# Altium project Decoupe_DMX.PrjPcb
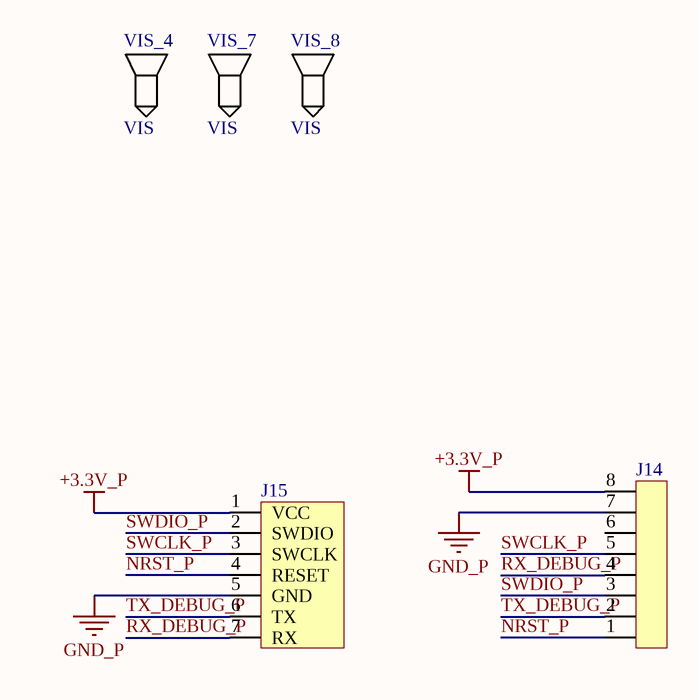
[diagram p0: ProgTool.SchDoc]
6 sheets, 168 parts. Net scope: global (net labels, ports and power ports of the same name join across sheets).
Board file: PCB.PcbDoc
Sheets:
  ProgTool.SchDoc
  IHM.SchDoc
  MCU.SchDoc
  Mechanical.SchDoc
  Outputs.SchDoc
  Power_Supply.SchDoc

## Sheet ProgTool.SchDoc: Carte Découpe DMX
size A4

### Parts
J14  (no value)  [BARF-2X4]
J15  (no value)  [CON_PROG]
VIS_4  VIS  [HOLE3.5mm]
VIS_7  VIS  [HOLE3.5mm]
VIS_8  VIS  [HOLE3.5mm]

### Nets
+3.3V_P: J14.8 J15.1(VCC)
GND_P: J14.7 J15.5(GND)
NRST_P: J14.1 J15.4(RESET)
RX_DEBUG_P: J14.4 J15.7(RX)
SWCLK_P: J14.5 J15.3(SWCLK)
SWDIO_P: J14.3 J15.2(SWDIO)
TX_DEBUG_P: J14.2 J15.6(TX)

Not connected (* = marked no-connect by the designer): J14 6

### Notes on the sheet
- Title
- Size:
- Date:
- A4
- Number:
- Time:
- Revision:
- Sheet
- of
- File:

### Library data of the parts
J14 = CON-8: Connector 8 points
J15 = CON-PROG: Programming Connector

## Sheet IHM.SchDoc: Carte Découpe DMX
size A4
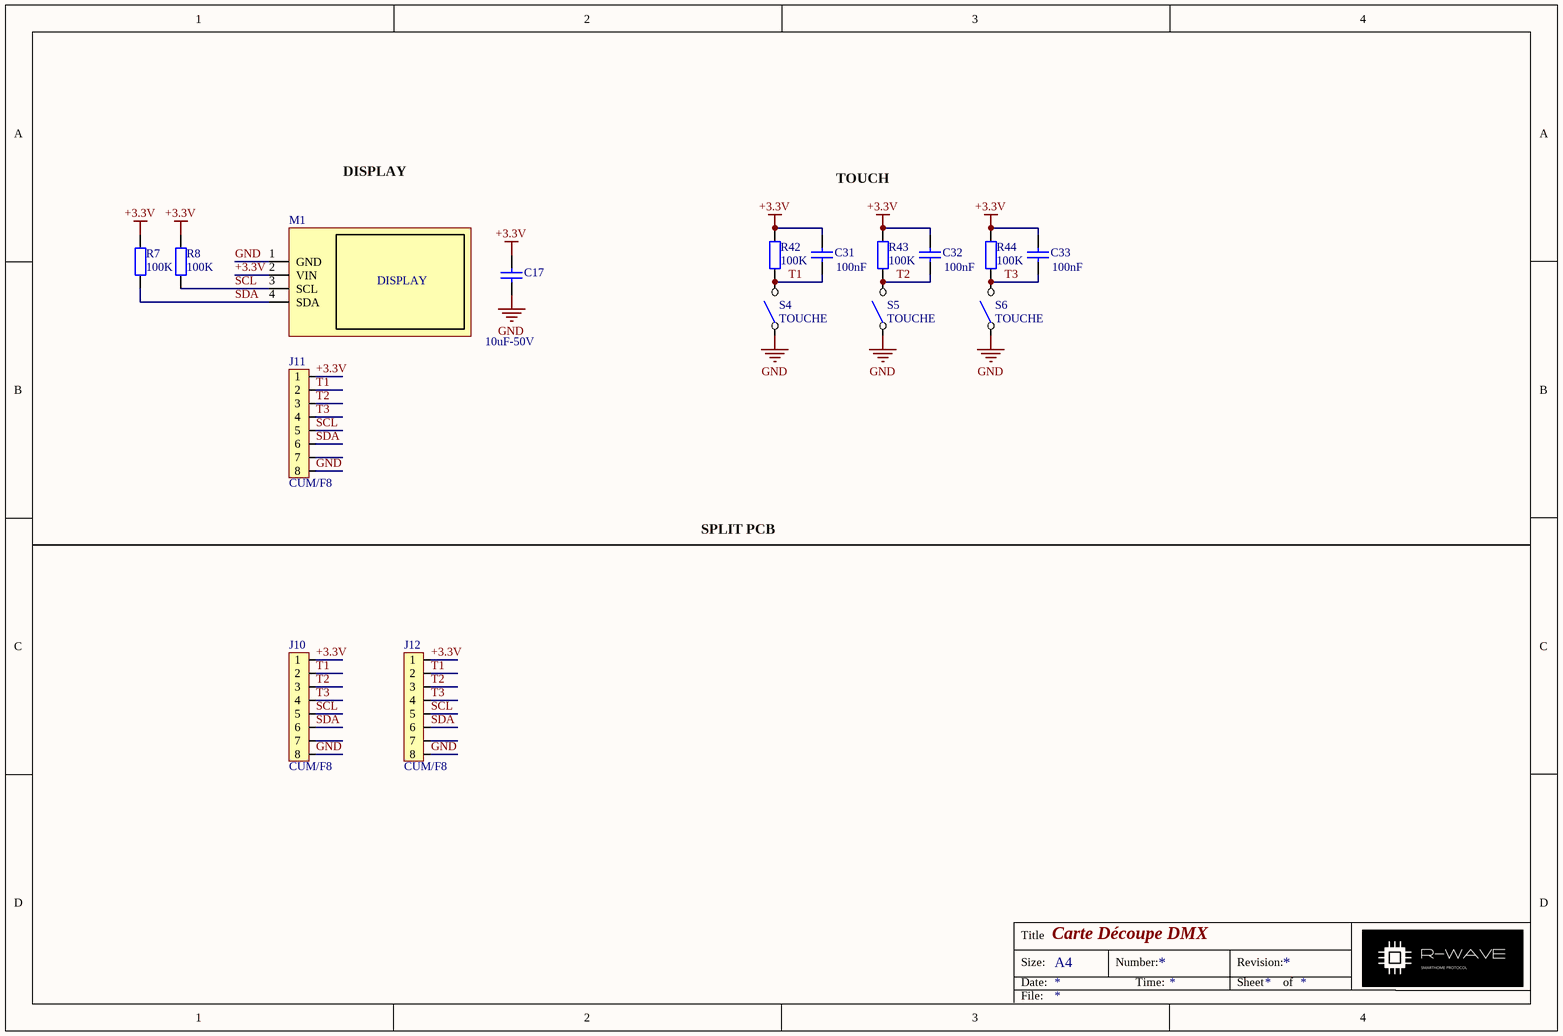
[diagram p1: IHM.SchDoc]

### Parts
C17  10uF-50V  [C1206]
C31  100nF  [C0603]
C32  100nF  [C0603]
C33  100nF  [C0603]
J10  CUM/F8  [BARF-2X4]
J11  CUM/F8  [BARF-2X4]
J12  CUM/F8  [BARF-2X4]
M1  (no value)  [I2C_OLED_0.96]
R7  100K  [R0603]
R8  100K  [R0603]
R42  100K  [R0603]
R43  100K  [R0603]
R44  100K  [R0603]
S4  TOUCHE  [INT-O]
S5  TOUCHE  [INT-O]
S6  TOUCHE  [INT-O]

### Nets
+3.3V: C17.2 C31.2 C32.2 C33.2 J10.1 J11.1 J12.1 M1.2(VIN) R7.2 R8.2 R42.2 R43.2 R44.2
GND: C17.1 J10.8 J11.8 J12.8 M1.1(GND) S4.1 S5.1 S6.1
SCL: J10.5 J11.5 J12.5 M1.3(SCL) R8.1
SDA: J10.6 J11.6 J12.6 M1.4(SDA) R7.1
T1: C31.1 J10.2 J11.2 J12.2 R42.1 S4.4
T2: C32.1 J10.3 J11.3 J12.3 R43.1 S5.4
T3: C33.1 J10.4 J11.4 J12.4 R44.1 S6.4

Not connected (* = marked no-connect by the designer): J10 7; J11 7; J12 7

### Notes on the sheet
- DISPLAY
- TOUCH
- SPLIT PCB
- Title
- Size:
- Date:
- A4
- Number:
- Time:
- Revision:
- Sheet
- of
- File:
- (in symbol I2C-OLED-0.96) DISPLAY

### Library data of the parts
C17 C31-C33 = Cap: Capacitor
  C17: Value: 10uF-50V
  C31-C33: Value: 100nF
J10-J12 = CUM/F8: connecteur 8 points
M1 = I2C-OLED-0.96: I2C OLED 0.96"
R7 R8 R42-R44 = Res: Thin Metal Film Resistor; Value: 100K

## Sheet MCU.SchDoc: Carte Découpe DMX
size A4
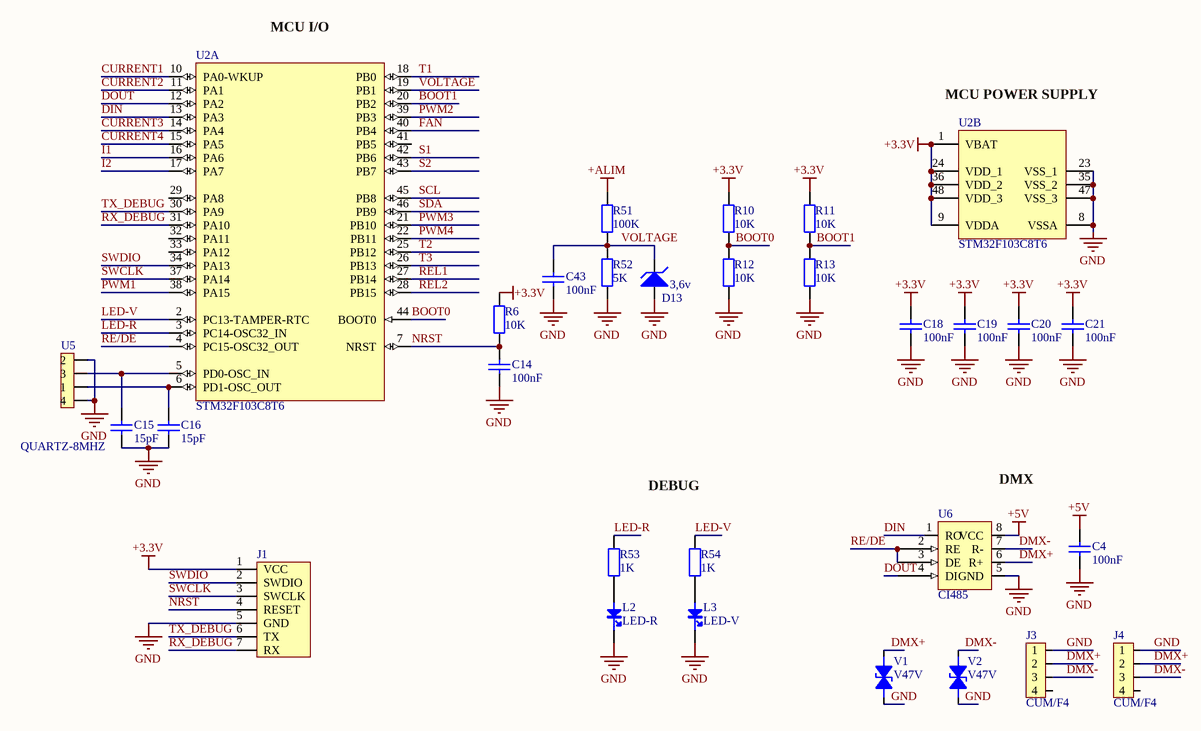
[diagram p2: MCU.SchDoc]

### Parts
C4  100nF  [C0603]
C14  100nF  [C0603]
C15  15pF  [C0603]
C16  15pF  [C0603]
C18  100nF  [C0603]
C19  100nF  [C0603]
C20  100nF  [C0603]
C21  100nF  [C0603]
C43  100nF  [C0603]
D13  3,6v  [SOD123]
J1  (no value)  [CON_PROG]
J3  CUM/F4  [CNT4S]
J4  CUM/F4  [CNT4S]
L2  LED-R  [LED-R1A]
L3  LED-V  [LED-V1A]
R6  10K  [R0603]
R10  10K  [R0603]
R11  10K  [R0603]
R12  10K  [R0603]
R13  10K  [R0603]
R51  100K  [R0603]
R52  5K  [R0603]
R53  1K  [R0603]
R54  1K  [R0603]
U2  STM32F103C8T6  [TQFP-48]  (parts A,B of 2)
U5  QUARTZ-8MHZ  [QUA8G]
U6  CI485  [CIA485A]
V1  V47V  [VAR47A]
V2  V47V  [VAR47A]

### Nets
+3.3V: C18.2 C19.2 C20.2 C21.2 J1.1(VCC) R6.2 R10.2 R11.2 U2.1(VBAT) U2.9(VDDA) U2.24(VDD_1) U2.36(VDD_2) U2.48(VDD_3)
+5V: C4.2 U6.8(VCC)
+ALIM: R51.2
GND: C4.1 C14.1 C15.2 C16.1 C18.1 C19.1 C20.1 C21.1 C43.1 D13.1(A) J1.5(GND) J3.1 J4.1 L2.2 L3.2 R12.1 R13.1 R52.1 U2.8(VSSA) U2.23(VSS_1) U2.35(VSS_2) U2.47(VSS_3) U5.2 U5.4 U6.5(GND) V1.2 V2.2
BOOT0: R10.1 R12.2 U2.44(BOOT0)
BOOT1: R11.1 R13.2 U2.20(PB2)
CURRENT1: U2.10(PA0-WKUP)
CURRENT2: U2.11(PA1)
CURRENT3: U2.14(PA4)
CURRENT4: U2.15(PA5)
DIN: U2.13(PA3) U6.1(RO)
DMX+: J3.2 J4.2 U6.6(R+) V1.1
DMX-: J3.3 J4.3 U6.7(R-) V2.1
DOUT: U2.12(PA2) U6.4(DI)
FAN: U2.40(PB4)
I1: U2.16(PA6)
I2: U2.17(PA7)
LED-R: R53.2 U2.3(PC14-OSC32_IN)
LED-V: R54.2 U2.2(PC13-TAMPER-RTC)
NRST: C14.2 J1.4(RESET) R6.1 U2.7(NRST)
PWM1: U2.38(PA15)
PWM2: U2.39(PB3)
PWM3: U2.21(PB10)
PWM4: U2.22(PB11)
RE/DE: U2.4(PC15-OSC32_OUT) U6.2(RE) U6.3(DE)
REL1: U2.27(PB14)
REL2: U2.28(PB15)
RX_DEBUG: J1.7(RX) U2.31(PA10)
S1: U2.42(PB6)
S2: U2.43(PB7)
SCL: U2.45(PB8)
SDA: U2.46(PB9)
SWCLK: J1.3(SWCLK) U2.37(PA14)
SWDIO: J1.2(SWDIO) U2.34(PA13)
T1: U2.18(PB0)
T2: U2.25(PB12)
T3: U2.26(PB13)
TX_DEBUG: J1.6(TX) U2.30(PA9)
VOLTAGE: C43.2 D13.2(K) R51.1 R52.2 U2.19(PB1)
NetC15_1: C15.1 U2.5(PD0-OSC_IN) U5.3
NetC16_2: C16.2 U2.6(PD1-OSC_OUT) U5.1
NetL2_1: L2.1 R53.1
NetL3_1: L3.1 R54.1

Not connected (* = marked no-connect by the designer): J3 4; J4 4; U2 29(PA8) 32(PA11) 33(PA12) 41(PB5)

### Notes on the sheet
- (near U2) MCU I/O
- (near U2) MCU POWER SUPPLY
- DEBUG
- (near U6) DMX
- Title
- Size:
- Date:
- A4
- Number:
- Time:
- Revision:
- Sheet
- of
- File:

### Library data of the parts
C4 C14-C16 C18-C21 C43 = Cap: Capacitor
  C4 C14 C18-C21 C43: Value: 100nF
  C15 C16: Value: 15pF
D13 = D Zener: Zener Diode; Value: 3,6v
J1 = CON-PROG: Programming Connector
J3 J4 = CUM/F4: connecteur  4 points
L2 = LED-R: LED  piquer ou CMS ou reverse rouge
L3 = LED-V: LED  piquer  ou  CMS verte
R6 R10-R13 R51-R54 = Res: Thin Metal Film Resistor
  R6 R10-R13: Value: 10K
  R51: Value: 100K
  R52: Value: 5K
  R53 R54: Value: 1K
U2 = STM32F103C8T6: ARM Cortex-M3 32-bit MCU, 64 KB Flash, 20 KB Internal RAM, 37 I/Os, 48-pin LQFP, -40 to 85 degC, Tray; Operating Frequency(F) (Processor speed) (MHz): 72; Supply Voltage(Vcc) min (V): 2; FLASH Size (Prog) (kB): 64; Internal RAM Size (kB): 20; I/Os (High Current): 37; A/D Converter: 2x12-bit (10 Channel); Core: ARM Cortex-M3; ComponentLink2Description: Datasheet; ComponentLink3Description: Package Specification; Mounting Technology: Surface Mount; ComponentLink3URL: http://www.st.com/st-web-ui/static/active/en/resource/technical/document/datasheet/DM00058181.pdf; DatasheetVersion: Rev. 16; ComponentLink1URL: http://www.st.com/web/en/home.html; ComponentLink1Description: Manufacturer URL; PartNumber: STM32F103C8T6; Packing: Tray; PackageVersion: Rev. 6, 06/2013; PackageReference: LQFP48; PackageDescription: 48-Pin Low Profile Quad Flat Package, 7 x 7 mm Body, 0.5 mm Pitch; ComponentLink2URL: http://www.st.com/st-web-ui/static/active/en/resource/technical/document/datasheet/CD00161566.pdf
U5 = QUARTZ-8MHZ: QUARTZ 8 MHZ CMS
U6 = CI485: DRIVER  RS485
V1 V2 = V47V: VARISTANCE 47V BOITIER 1206

## Sheet Mechanical.SchDoc: Carte Découpe DMX
size A4
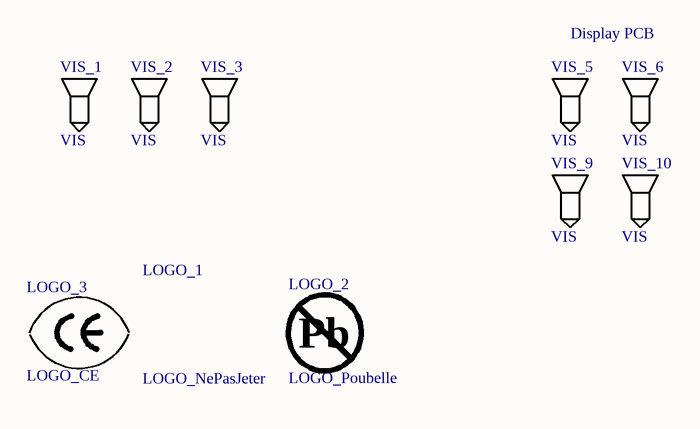
[diagram p3: Mechanical.SchDoc]

### Parts
LOGO_1  LOGO_NePasJeter  [LogoNePasJeter]
LOGO_2  LOGO_Poubelle  [LogoPB]
LOGO_3  LOGO_CE  [LogoCE]
VIS_1  VIS  [HOLE3.5mm]
VIS_2  VIS  [HOLE3.5mm]
VIS_3  VIS  [HOLE3.5mm]
VIS_5  VIS  [HOLE3.5mm]
VIS_6  VIS  [HOLE3.5mm]
VIS_9  VIS  [HOLE3.5mm]
VIS_10  VIS  [HOLE3.5mm]

### Notes on the sheet
- Display PCB
- Title
- Size:
- Date:
- A4
- Number:
- Time:
- Revision:
- Sheet
- of
- File:
- (in symbol LOGO_Poubelle) Pb

### Library data of the parts
LOGO_1 = LOGO_NePasJeter: Logo Ne Pas Jeter (sérigraphie)
LOGO_2 = LOGO_Poubelle: Logo poubelle (sérigraphie)
LOGO_3 = LOGO_CE: Logo CE (sérigraphie)

## Sheet Outputs.SchDoc: Carte Découpe DMX
size A4
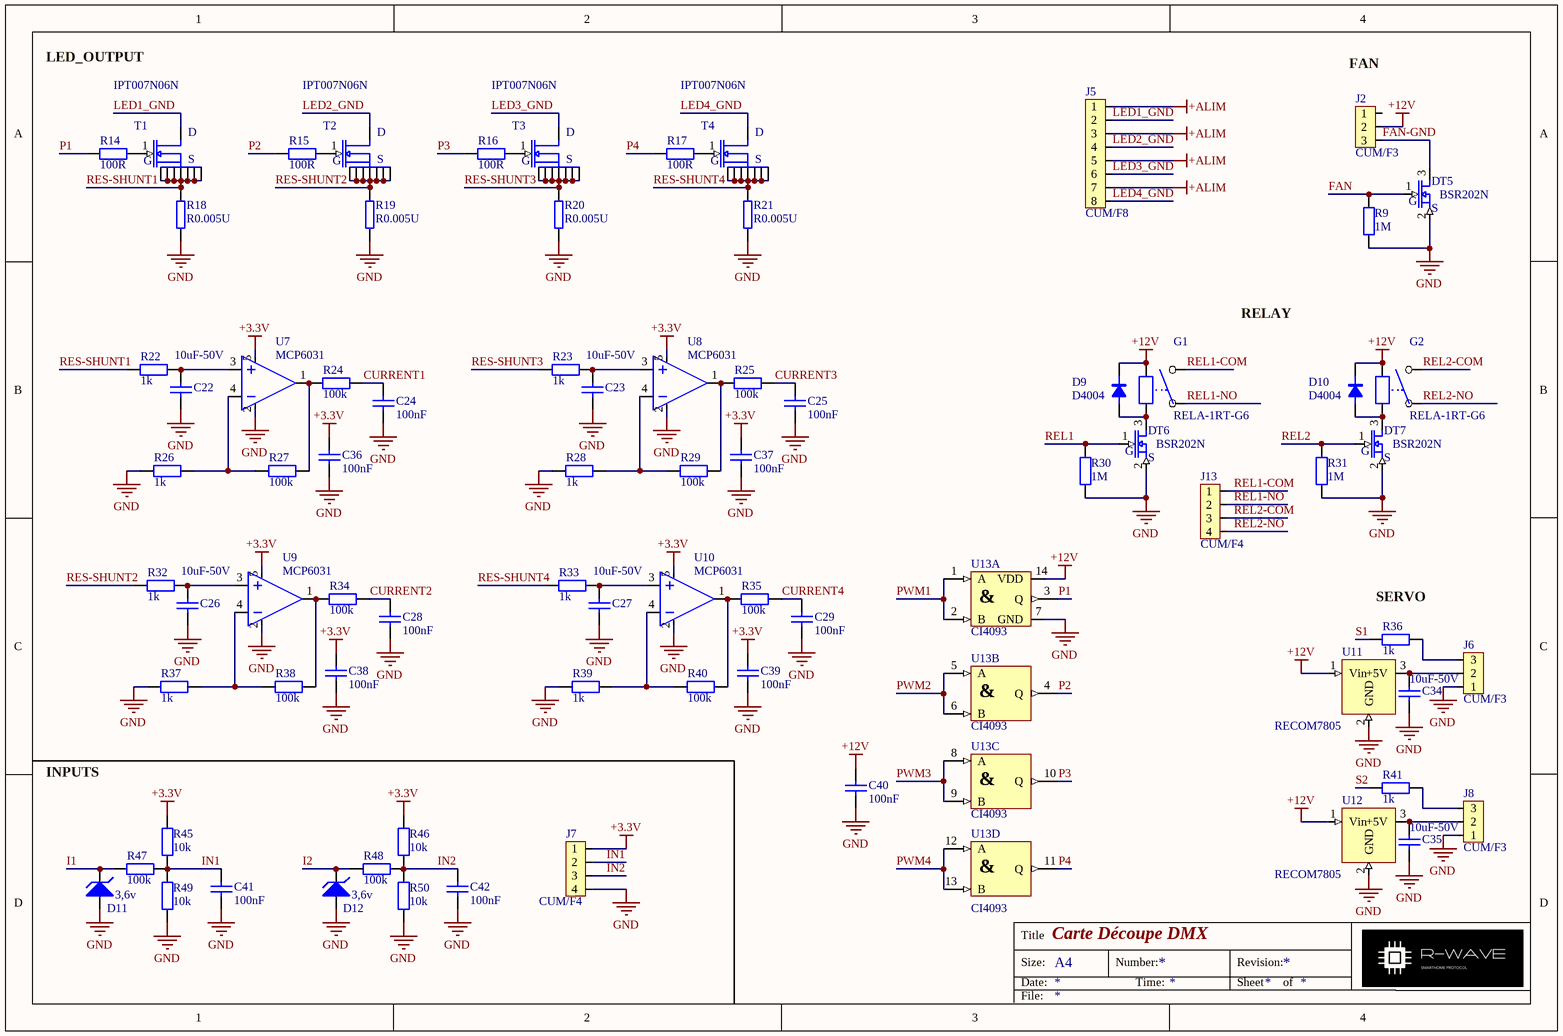
[diagram p4: Outputs.SchDoc]

### Parts
C22  10uF-50V  [C1206]
C23  10uF-50V  [C1206]
C24  100nF  [C0603]
C25  100nF  [C0603]
C26  10uF-50V  [C1206]
C27  10uF-50V  [C1206]
C28  100nF  [C0603]
C29  100nF  [C0603]
C34  10uF-50V  [C1206]
C35  10uF-50V  [C1206]
C36  100nF  [C0603]
C37  100nF  [C0603]
C38  100nF  [C0603]
C39  100nF  [C0603]
C40  100nF  [C0603]
C41  100nF  [C0603]
C42  100nF  [C0603]
D9  D4004  [DIO4004A]
D10  D4004  [DIO4004A]
D11  3,6v  [SOD123]
D12  3,6v  [SOD123]
G1  RELA-1RT-G6  [RELG6D1A]
G2  RELA-1RT-G6  [RELG6D1A]
J2  CUM/F3  [HDR1X3]
J5  CUM/F8  [CNT8C3]
J6  CUM/F3  [HDR1X3]
J7  CUM/F4  [CNT4J]
J8  CUM/F3  [HDR1X3]
J13  CUM/F4  [CNT4F0]
R9  1M  [R0603]
R14  100R  [R0603]
R15  100R  [R0603]
R16  100R  [R0603]
R17  100R  [R0603]
R18  R0.005U  [RCER005]
R19  R0.005U  [RCER005]
R20  R0.005U  [RCER005]
R21  R0.005U  [RCER005]
R22  1k  [R0603]
R23  1k  [R0603]
R24  100k  [R0603]
R25  100k  [R0603]
R26  1k  [R0603]
R27  100k  [R0603]
R28  1k  [R0603]
R29  100k  [R0603]
R30  1M  [R0603]
R31  1M  [R0603]
R32  1k  [R0603]
R33  1k  [R0603]
R34  100k  [R0603]
R35  100k  [R0603]
R36  1k  [R0603]
R37  1k  [R0603]
R38  100k  [R0603]
R39  1k  [R0603]
R40  100k  [R0603]
R41  1k  [R0603]
R45  10k  [R0603]
R46  10k  [R0603]
R47  100k  [R0603]
R48  100k  [R0603]
R49  10k  [R0603]
R50  10k  [R0603]
T1  IPT007N06N  [TRA007]
T2  IPT007N06N  [TRA007]
T3  IPT007N06N  [TRA007]
T4  IPT007N06N  [TRA007]
T5  BSR202N  [TRA202]
T6  BSR202N  [TRA202]
T7  BSR202N  [TRA202]
U7  MCP6031  [CIA6031]
U8  MCP6031  [CIA6031]
U9  MCP6031  [CIA6031]
U10  MCP6031  [CIA6031]
U11  RECOM7805  [REG5VG]
U12  RECOM7805  [REG5VG]
U13  CI4093  [CIL4093]  (parts A,B,C,D of 4)

### Nets
+3.3V: C36.2 C37.2 C38.2 C39.2 J7.1 R45.1 R46.1 U7.5(VDD) U8.5(VDD) U9.5(VDD) U10.5(VDD)
+12V: C40.2 D9.1 D10.1 G1.7 G2.7 J2.2 U11.1(Vin) U12.1(Vin) U13.14(VDD)
+ALIM: J5.1 J5.3 J5.5 J5.7
GND: C22.1 C23.1 C24.2 C25.2 C26.1 C27.1 C28.2 C29.2 C34.1 C35.1 C36.1 C37.1 C38.1 C39.1 C40.1 C41.1 C42.1 D11.1(A) D12.1(A) J6.1 J7.4 J8.1 R9.1 R18.1 R19.1 R20.1 R21.1 R26.2 R28.2 R30.1 R31.1 R37.2 R39.2 R49.2 R50.2 T5.2(S) T6.2(S) T7.2(S) U7.2(VSS) U8.2(VSS) U9.2(VSS) U10.2(VSS) U11.2(GND) U12.2(GND) U13.7(GND)
CURRENT1: C24.1 R24.1
CURRENT2: C28.1 R34.1
CURRENT3: C25.1 R25.1
CURRENT4: C29.1 R35.1
FAN: R9.2 T5.1(G)
FAN-GND: J2.3 T5.3(D)
I1: D11.2(K) R47.2
I2: D12.2(K) R48.2
IN1: C41.2 J7.2 R45.2 R47.1 R49.1
IN2: C42.2 J7.3 R46.2 R48.1 R50.1
LED1_GND: J5.2 T1.9
LED2_GND: J5.4 T2.9
LED3_GND: J5.6 T3.9
LED4_GND: J5.8 T4.9
P1: R14.2 U13.3(Q)
P2: R15.2 U13.4(Q)
P3: R16.2 U13.10(Q)
P4: R17.2 U13.11(Q)
PWM1: U13.1(A) U13.2(B)
PWM2: U13.5(A) U13.6(B)
PWM3: U13.8(A) U13.9(B)
PWM4: U13.12(A) U13.13(B)
REL1: R30.2 T6.1(G)
REL1-COM: G1.2 J13.1
REL1-NO: G1.3 J13.2
REL2: R31.2 T7.1(G)
REL2-COM: G2.2 J13.3
REL2-NO: G2.3 J13.4
RES-SHUNT1: R18.2 R22.2 T1.2 T1.3 T1.4 T1.5 T1.6 T1.7 T1.8
RES-SHUNT2: R19.2 R32.2 T2.2 T2.3 T2.4 T2.5 T2.6 T2.7 T2.8
RES-SHUNT3: R20.2 R23.2 T3.2 T3.3 T3.4 T3.5 T3.6 T3.7 T3.8
RES-SHUNT4: R21.2 R33.2 T4.2 T4.3 T4.4 T4.5 T4.6 T4.7 T4.8
S1: R36.2
S2: R41.2
NetC22_2: C22.2 R22.1 U7.3(Vin+)
NetC23_2: C23.2 R23.1 U8.3(Vin+)
NetC26_2: C26.2 R32.1 U9.3(Vin+)
NetC27_2: C27.2 R33.1 U10.3(Vin+)
NetC34_2: C34.2 J6.2 U11.3(+5V)
NetC35_2: C35.2 J8.2 U12.3(+5V)
NetD9_2: D9.2 G1.8 T6.3(D)
NetD10_2: D10.2 G2.8 T7.3(D)
NetJ6_3: J6.3 R36.1
NetJ8_3: J8.3 R41.1
NetR14_1: R14.1 T1.1
NetR15_1: R15.1 T2.1
NetR16_1: R16.1 T3.1
NetR17_1: R17.1 T4.1
NetR24_2: R24.2 R27.1 U7.1(Vout)
NetR25_2: R25.2 R29.1 U8.1(Vout)
NetR26_1: R26.1 R27.2 U7.4(Vin-)
NetR28_1: R28.1 R29.2 U8.4(Vin-)
NetR34_2: R34.2 R38.1 U9.1(Vout)
NetR35_2: R35.2 R40.1 U10.1(Vout)
NetR37_1: R37.1 R38.2 U9.4(Vin-)
NetR39_1: R39.1 R40.2 U10.4(Vin-)

Not connected (* = marked no-connect by the designer): J2 1

### Notes on the sheet
- LED_OUTPUT
- (near J2) FAN
- RELAY
- (near R36) SERVO
- INPUTS
- Title
- Size:
- Date:
- A4
- Number:
- Time:
- Revision:
- Sheet
- of
- File:
- (in symbol CI4093, part A) &
- (in symbol CI4093, part B) &
- (in symbol CI4093, part C) &
- (in symbol CI4093, part D) &
- (in symbol IPT007N06N) D; G; S

### Library data of the parts
C22-C29 C34-C42 = Cap: Capacitor
  C22 C23 C26 C27 C34 C35: Value: 10uF-50V
  C24 C25 C28 C29 C36-C42: Value: 100nF
D9 D10 = D4004: DIODE CMS 1A 400V  boitier DO214AC
D11 D12 = D Zener: Zener Diode; Value: 3,6v
G1 G2 = RELA-1RT-G6: RELAIS 1RT 12V
J2 J6 J8 = CUM/F3: connecteur 3 points
J5 = CUM/F8: connecteur 8 points
J7 J13 = CUM/F4: connecteur  4 points
R9 R14-R17 R22-R41 R45-R50 = Res: Thin Metal Film Resistor
  R9 R30 R31: Value: 1M
  R14-R17: Value: 100R
  R22 R23 R26 R28 R32 R33 R36 R37 R39 R41: Value: 1k
  R24 R25 R27 R29 R34 R35 R38 R40 R47 R48: Value: 100k
  R45 R46 R49 R50: Value: 10k
R18-R21 = R0.005U: Resistance 0.005U 1W 1% CMS BOITIER 2512
T1-T4 = IPT007N06N: TRANSISTOR MOS N
T5-T7 = BSR202N: TRANSISTOR MOS N
U7-U10 = MCP6031: SOT23
U11 U12 = RECOM7805: Régulateur à piquer recom
U13 = CI4093: Quad NAND gate

## Sheet Power_Supply.SchDoc: Carte Découpe DMX
size A4
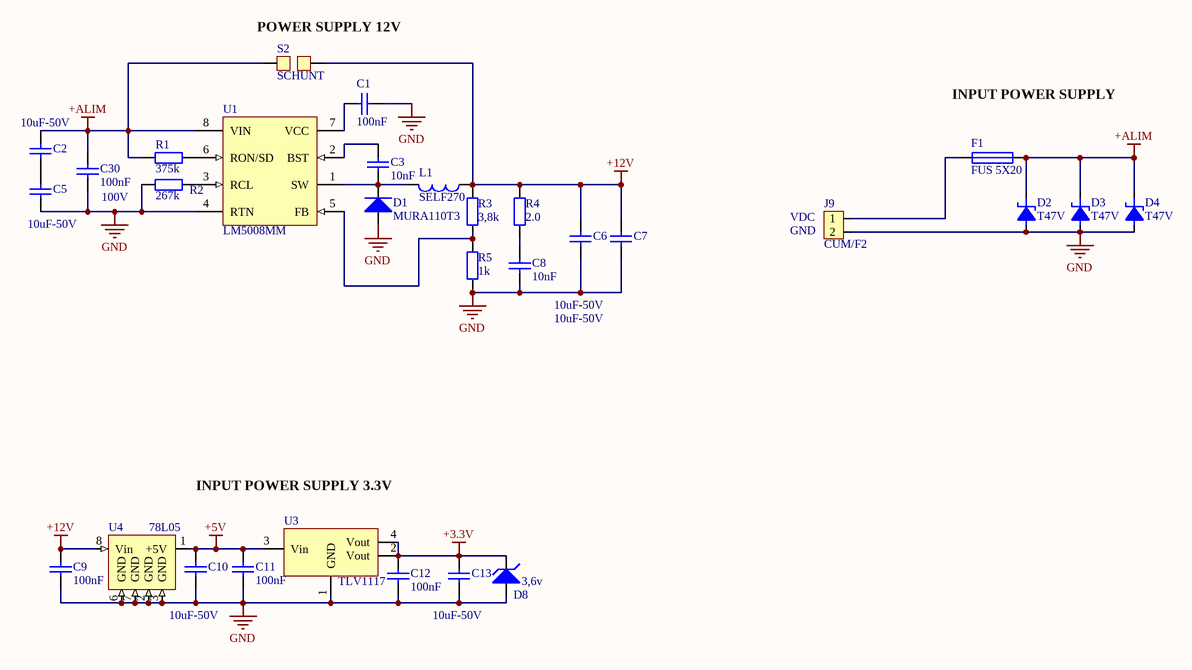
[diagram p5: Power_Supply.SchDoc]

### Parts
C1  100nF  [C0603]
C2  10uF-50V  [C1206]
C3  10nF  [C0603]
C5  10uF-50V  [C1206]
C6  10uF-50V  [C1206]
C7  10uF-50V  [C1206]
C8  10nF  [C0603]
C9  100nF  [C0603]
C10  10uF-50V  [C1206]
C11  100nF  [C0603]
C12  100nF  [C0603]
C13  10uF-50V  [C1206]
C30  100nF  [C0603]
D1  MURA110T3  [DO-214AC]
D2  T47V  [DIO47A]
D3  T47V  [DIO47A]
D4  T47V  [DIO47A]
D8  3,6v  [SOD123]
F1  FUS 5X20  [FUSPO-A1]
J9  CUM/F2  [CNT2H]
L1  SELF270  [SELF270]
R1  375k  [R0603]
R2  267k  [R0603]
R3  3,8k  [R0603]
R4  2.0  [R0603]
R5  1k  [R0603]
S2  SCHUNT  [SCHUNT]
U1  LM5008MM  [MUA08A_M]
U3  TLV1117  [SOT223]
U4  78L05  [REG5VE]

### Nets
+3.3V: C12.1 C13.2 D8.2(K) U3.2(Vout) U3.4(Vout)
+5V: C10.2 C11.1 U3.3(Vin) U4.1(+5V)
+12V: C6.2 C7.2 C9.1 L1.2 R3.1 R4.1 S2.1 U4.8(Vin)
+ALIM: C2.2 C30.1 D2.1 D3.1 D4.1 F1.2 R1.2 S2.2 U1.8(VIN)
GND: C1.1 C5.1 C6.1 C7.1 C8.1 C9.2 C10.1 C11.2 C12.2 C13.1 C30.2 D1.1(A) D2.2 D3.2 D4.2 D8.1(A) J9.2 R2.2 R5.2 U1.4(RTN) U3.1(GND) U4.2(GND) U4.3(GND) U4.6(GND) U4.7(GND)
NetC1_2: C1.2 U1.7(VCC)
NetC2_1: C2.1 C5.2
NetC3_1: C3.1 D1.2(K) L1.1 U1.1(SW)
NetC3_2: C3.2 U1.2(BST)
NetC8_2: C8.2 R4.2
NetF1_1: F1.1 J9.1
NetR1_1: R1.1 U1.6(RON/SD)
NetR2_1: R2.1 U1.3(RCL)
NetR3_2: R3.2 R5.1 U1.5(FB)

### Notes on the sheet
- (near S2) POWER SUPPLY 12V
- INPUT POWER SUPPLY
- 100V
- (near J9) VDC
- (near J9) GND
- INPUT POWER SUPPLY 3.3V
- Title
- Size:
- Date:
- A4
- Number:
- Time:
- Revision:
- Sheet
- of
- File:

### Library data of the parts
C1-C3 C5-C13 C30 = Cap: Capacitor
  C1 C9 C11 C12 C30: Value: 100nF
  C2 C5-C7 C10 C13: Value: 10uF-50V
  C3 C8: Value: 10nF
D1 = Diode: Ref_Fabricant: MURA110T3
D2-D4 = T47V: TRANSIL CMS 47V unidirectionnelle
D8 = D Zener: Zener Diode; Value: 3,6v
F1 = FUS 5X20: FUSIBLE VERRE 5 x 20
J9 = CUM/F2: connecteur  2 points
L1 = SELF270: self 270uH
R1 R3-R5 = Res: Thin Metal Film Resistor
  R1: Value: 375k
  R3: Value: 3,8k
  R4: Value: 2.0
  R5: Value: 1k
R2 = Res: Thin Metal Film Resistor; Value: 375k
S2 = SCHUNT: schunt 2 points
U1 = LM5008MM: High Voltage (100V) Step Down Switching Regulator, 8-pin MSOP; Manufacturer: National Semiconductor; PackageTopMarking: ZXTT*SAYB; PowerWise: N; CompType: Switcher; ComponentLink1Description: LM5008 Datasheet; ComponentLink2Description: LM5008 Web Page; DatasheetVersion: Apr-2009; ComponentLink3Description: MUA08A Package Page; PinCount: 8; ComponentLink1URL: http://www.national.com/ds/LM/LM5008.pdf; ComponentLink2URL: http://www.national.com/pf/LM/LM5008.html; Code_JEDEC: MO-187-AA; RevisionNote: Component URLs added; ComponentLink3URL: http://www.national.com/packaging/folders/mua08a.html; PackageVersion: revF, Apr-2008; PackageDescription: MINI SOIC, .118 x .118 x .034in, 8 Lead, .0256in Pitch; RoHS: N; PackageReference: MUA08A; PartNumber: LM5008MM
U3 = TLV1117: LDO regulator 3.3V; Fabricant: Texas; Fournisseur: Farnell; Ref_Fournisseur: 1703385; Prix: 0.75; Ref_Fabricant: TLV1117
U4 = 78L05: E:cms ;C1:faible conso; VD:TO220 debout;

## Nets that join several sheets
+3.3V: IHM (13 pins), MCU (13 pins), Outputs (11 pins), Power_Supply (5 pins)
+5V: MCU (C4.2 U6.8), Power_Supply (C10.2 C11.1 U3.3 U4.1)
+12V: Outputs (9 pins), Power_Supply (8 pins)
+ALIM: MCU (R51.2), Outputs (J5.1 J5.3 J5.5 J5.7), Power_Supply (9 pins)
GND: IHM (8 pins), MCU (27 pins), Outputs (45 pins), Power_Supply (25 pins)
CURRENT1: MCU (U2.10), Outputs (C24.1 R24.1)
CURRENT2: MCU (U2.11), Outputs (C28.1 R34.1)
CURRENT3: MCU (U2.14), Outputs (C25.1 R25.1)
CURRENT4: MCU (U2.15), Outputs (C29.1 R35.1)
FAN: MCU (U2.40), Outputs (R9.2 T5.1)
I1: MCU (U2.16), Outputs (D11.2 R47.2)
I2: MCU (U2.17), Outputs (D12.2 R48.2)
PWM1: MCU (U2.38), Outputs (U13.1 U13.2)
PWM2: MCU (U2.39), Outputs (U13.5 U13.6)
PWM3: MCU (U2.21), Outputs (U13.8 U13.9)
PWM4: MCU (U2.22), Outputs (U13.12 U13.13)
REL1: MCU (U2.27), Outputs (R30.2 T6.1)
REL2: MCU (U2.28), Outputs (R31.2 T7.1)
S1: MCU (U2.42), Outputs (R36.2)
S2: MCU (U2.43), Outputs (R41.2)
SCL: IHM (5 pins), MCU (U2.45)
SDA: IHM (5 pins), MCU (U2.46)
T1: IHM (6 pins), MCU (U2.18)
T2: IHM (6 pins), MCU (U2.25)
T3: IHM (6 pins), MCU (U2.26)

## Assembly variants
Decoupe: not fitted C23 C25 C26 C27 C28 C29 D2 D3 D4 D9 D10 G1 G2 J6 J7 J8 R15 R16 R17 R19 R20 R21 R23 R25 R28 R29 R30 R31 R32 R33 R34 R35 R36 R37 R38 R39 R40 R41 S2 T2 T3 T4 T6 T7 U9 U10 U11 U12